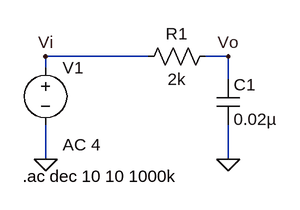
[diagram p0: schematic Figure26-1.asc]
Figure26-1.asc, the LTspice schematic file:
Version 4
SHEET 1 880 680
WIRE 160 112 16 112
WIRE 272 112 240 112
WIRE 16 128 16 112
WIRE 272 144 272 112
WIRE 16 256 16 208
WIRE 272 256 272 208
FLAG 16 256 0
FLAG 16 112 Vi
FLAG 272 256 0
FLAG 272 112 Vo
SYMBOL voltage 16 112 R0
WINDOW 123 24 124 Left 2
WINDOW 39 0 0 Left 0
SYMATTR Value2 AC 4
SYMATTR InstName V1
SYMATTR Value ""
SYMBOL res 256 96 R90
WINDOW 0 0 56 VBottom 2
WINDOW 3 32 56 VTop 2
SYMATTR InstName R1
SYMATTR Value 2k
SYMBOL cap 256 144 R0
SYMATTR InstName C1
SYMATTR Value 0.02µ
TEXT -16 280 Left 2 !.ac dec 10 10 1000k

The netlist it stands for:
* Figure26-1.asc
V1 Vi 0 AC 4
R1 Vo Vi 2k
C1 Vo 0 0.02µ
.ac dec 10 10 1000k
.backanno
.end